# EasyEDA Pro project UHUB.eprj, schematic UHUB

## Sheets
1 USB-HUB: Board Name: Board1; Create Date: 2025-02-08; Page Name: USB-HUB; Project Name: UHUB; Schematic Name: UHUB; Update Date: 2025-03-03; Company: CAN; Page Size: A4; Version: V1.0
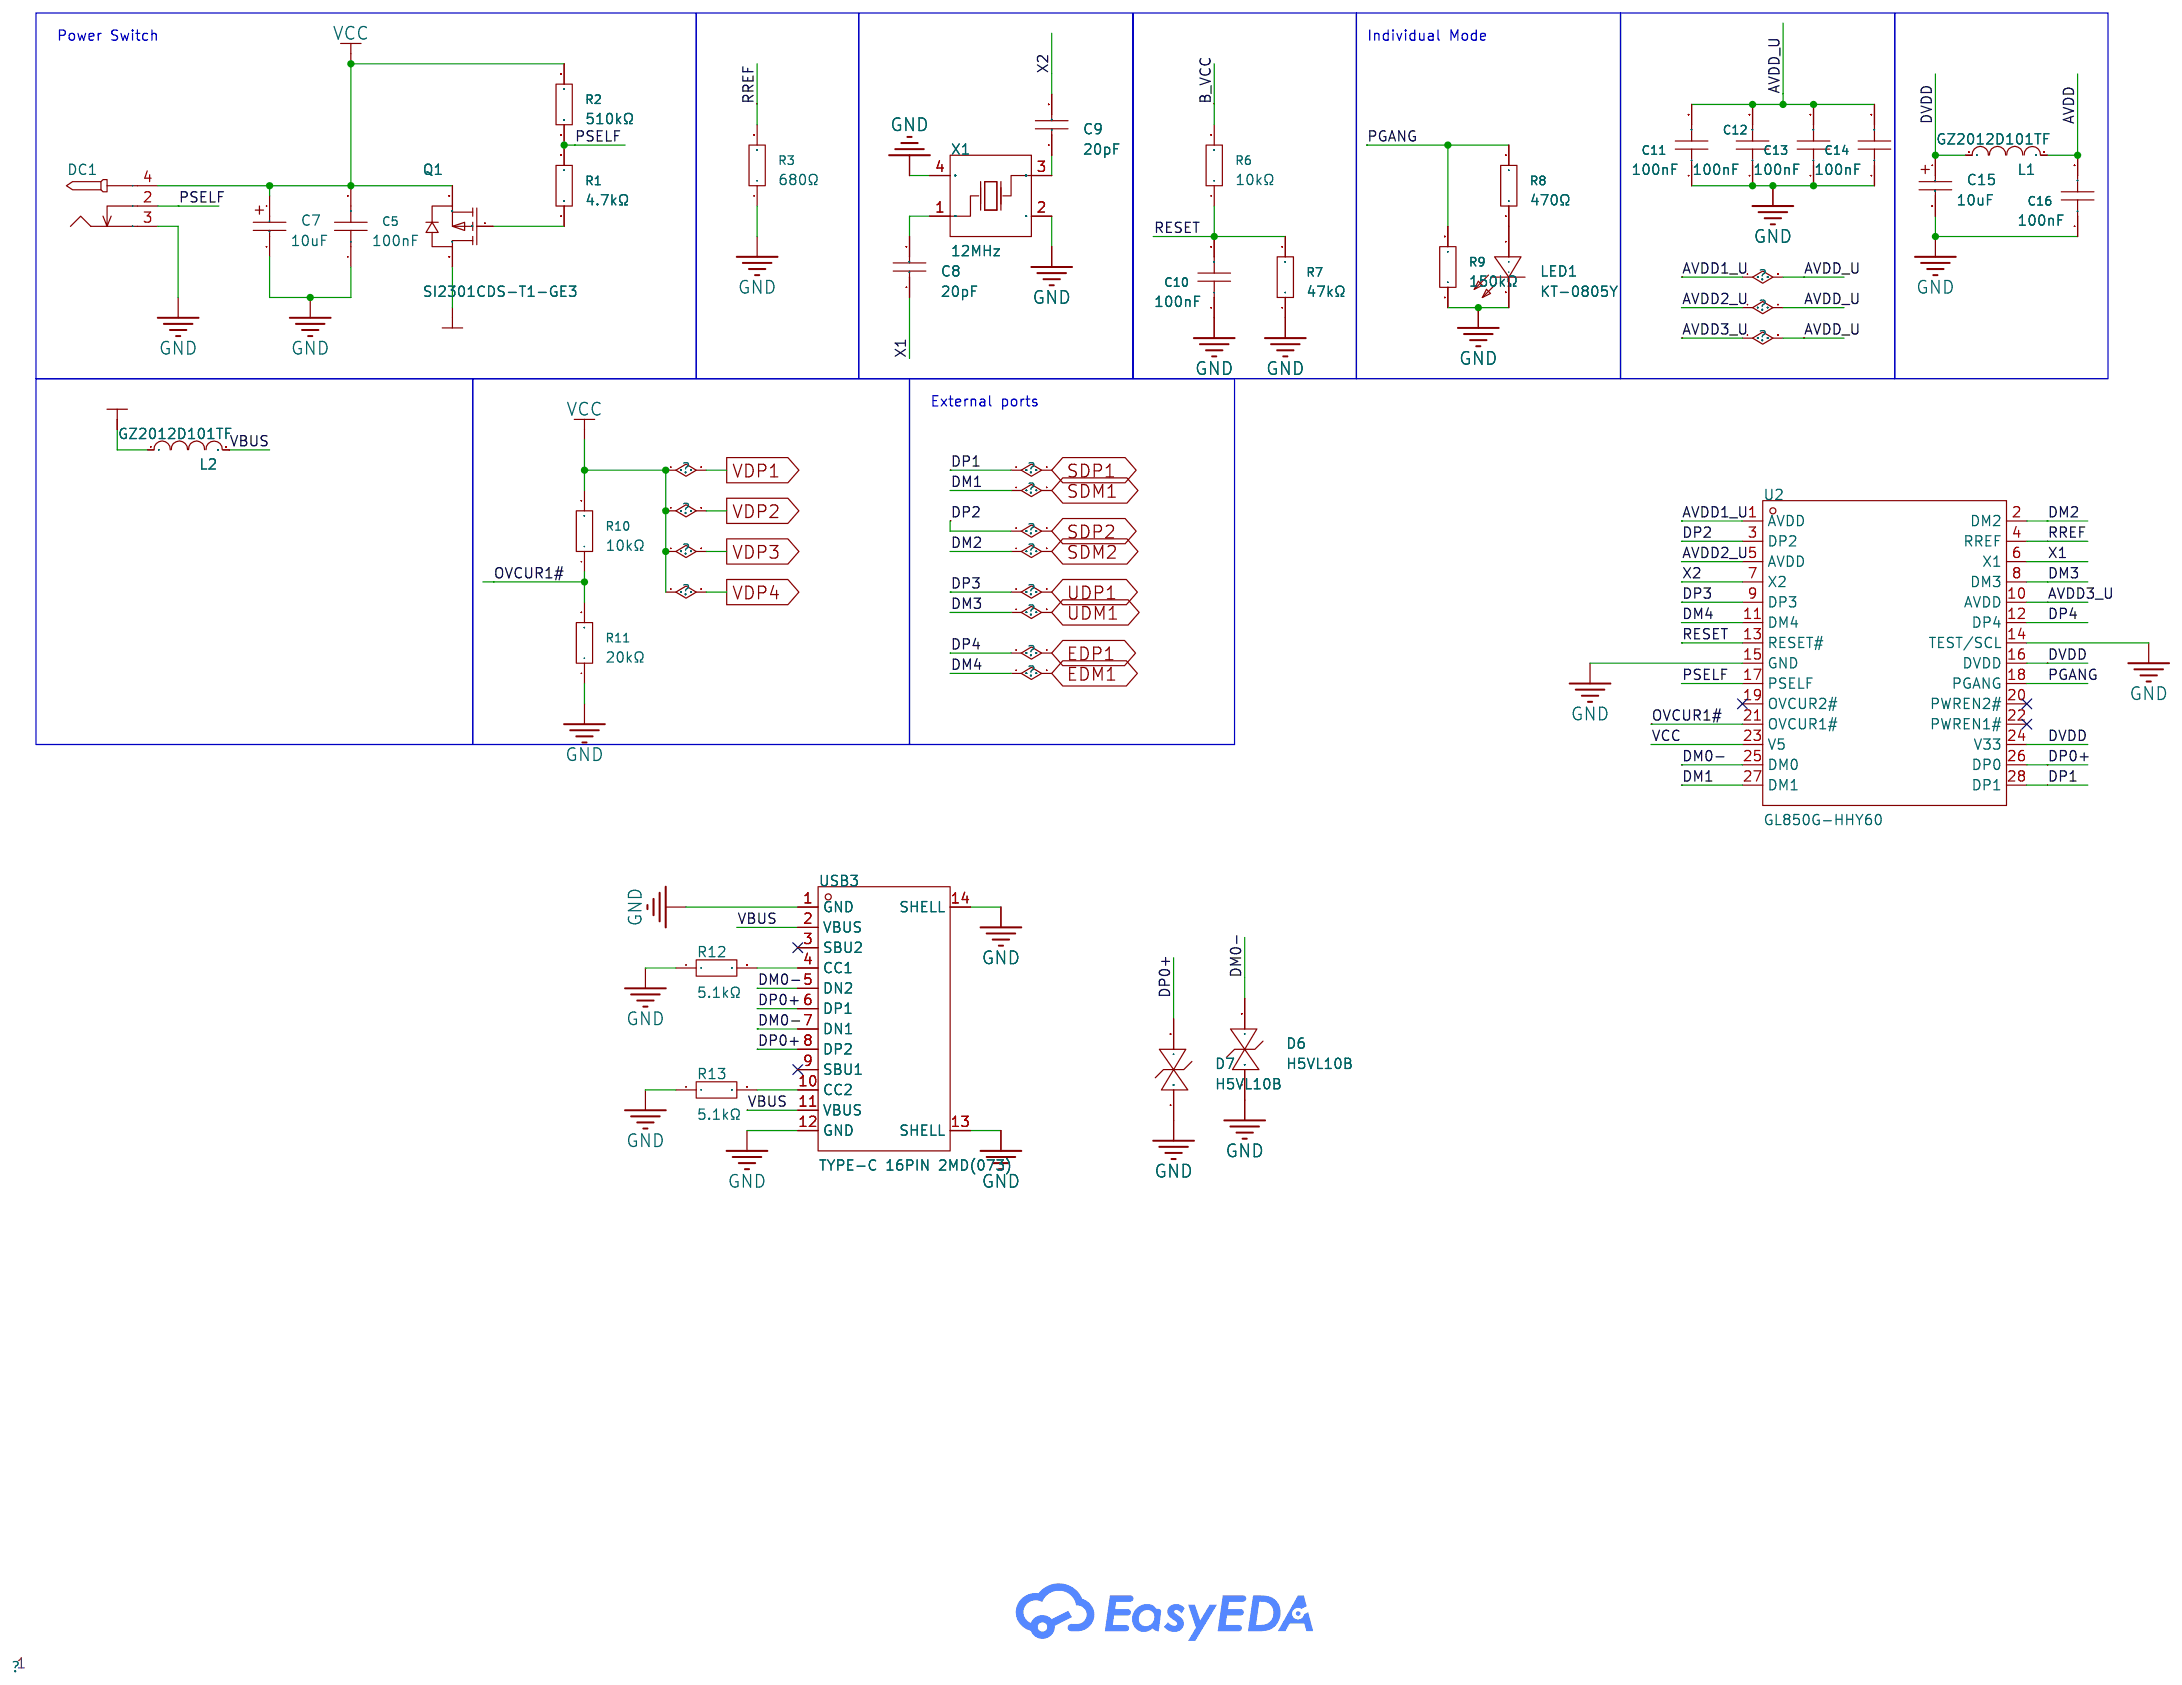
[diagram p0: USB-HUB]
2 USB-Serial: Page Name: USB-Serial; Update Date: 2025-02-23; Company: EasyEDA.com
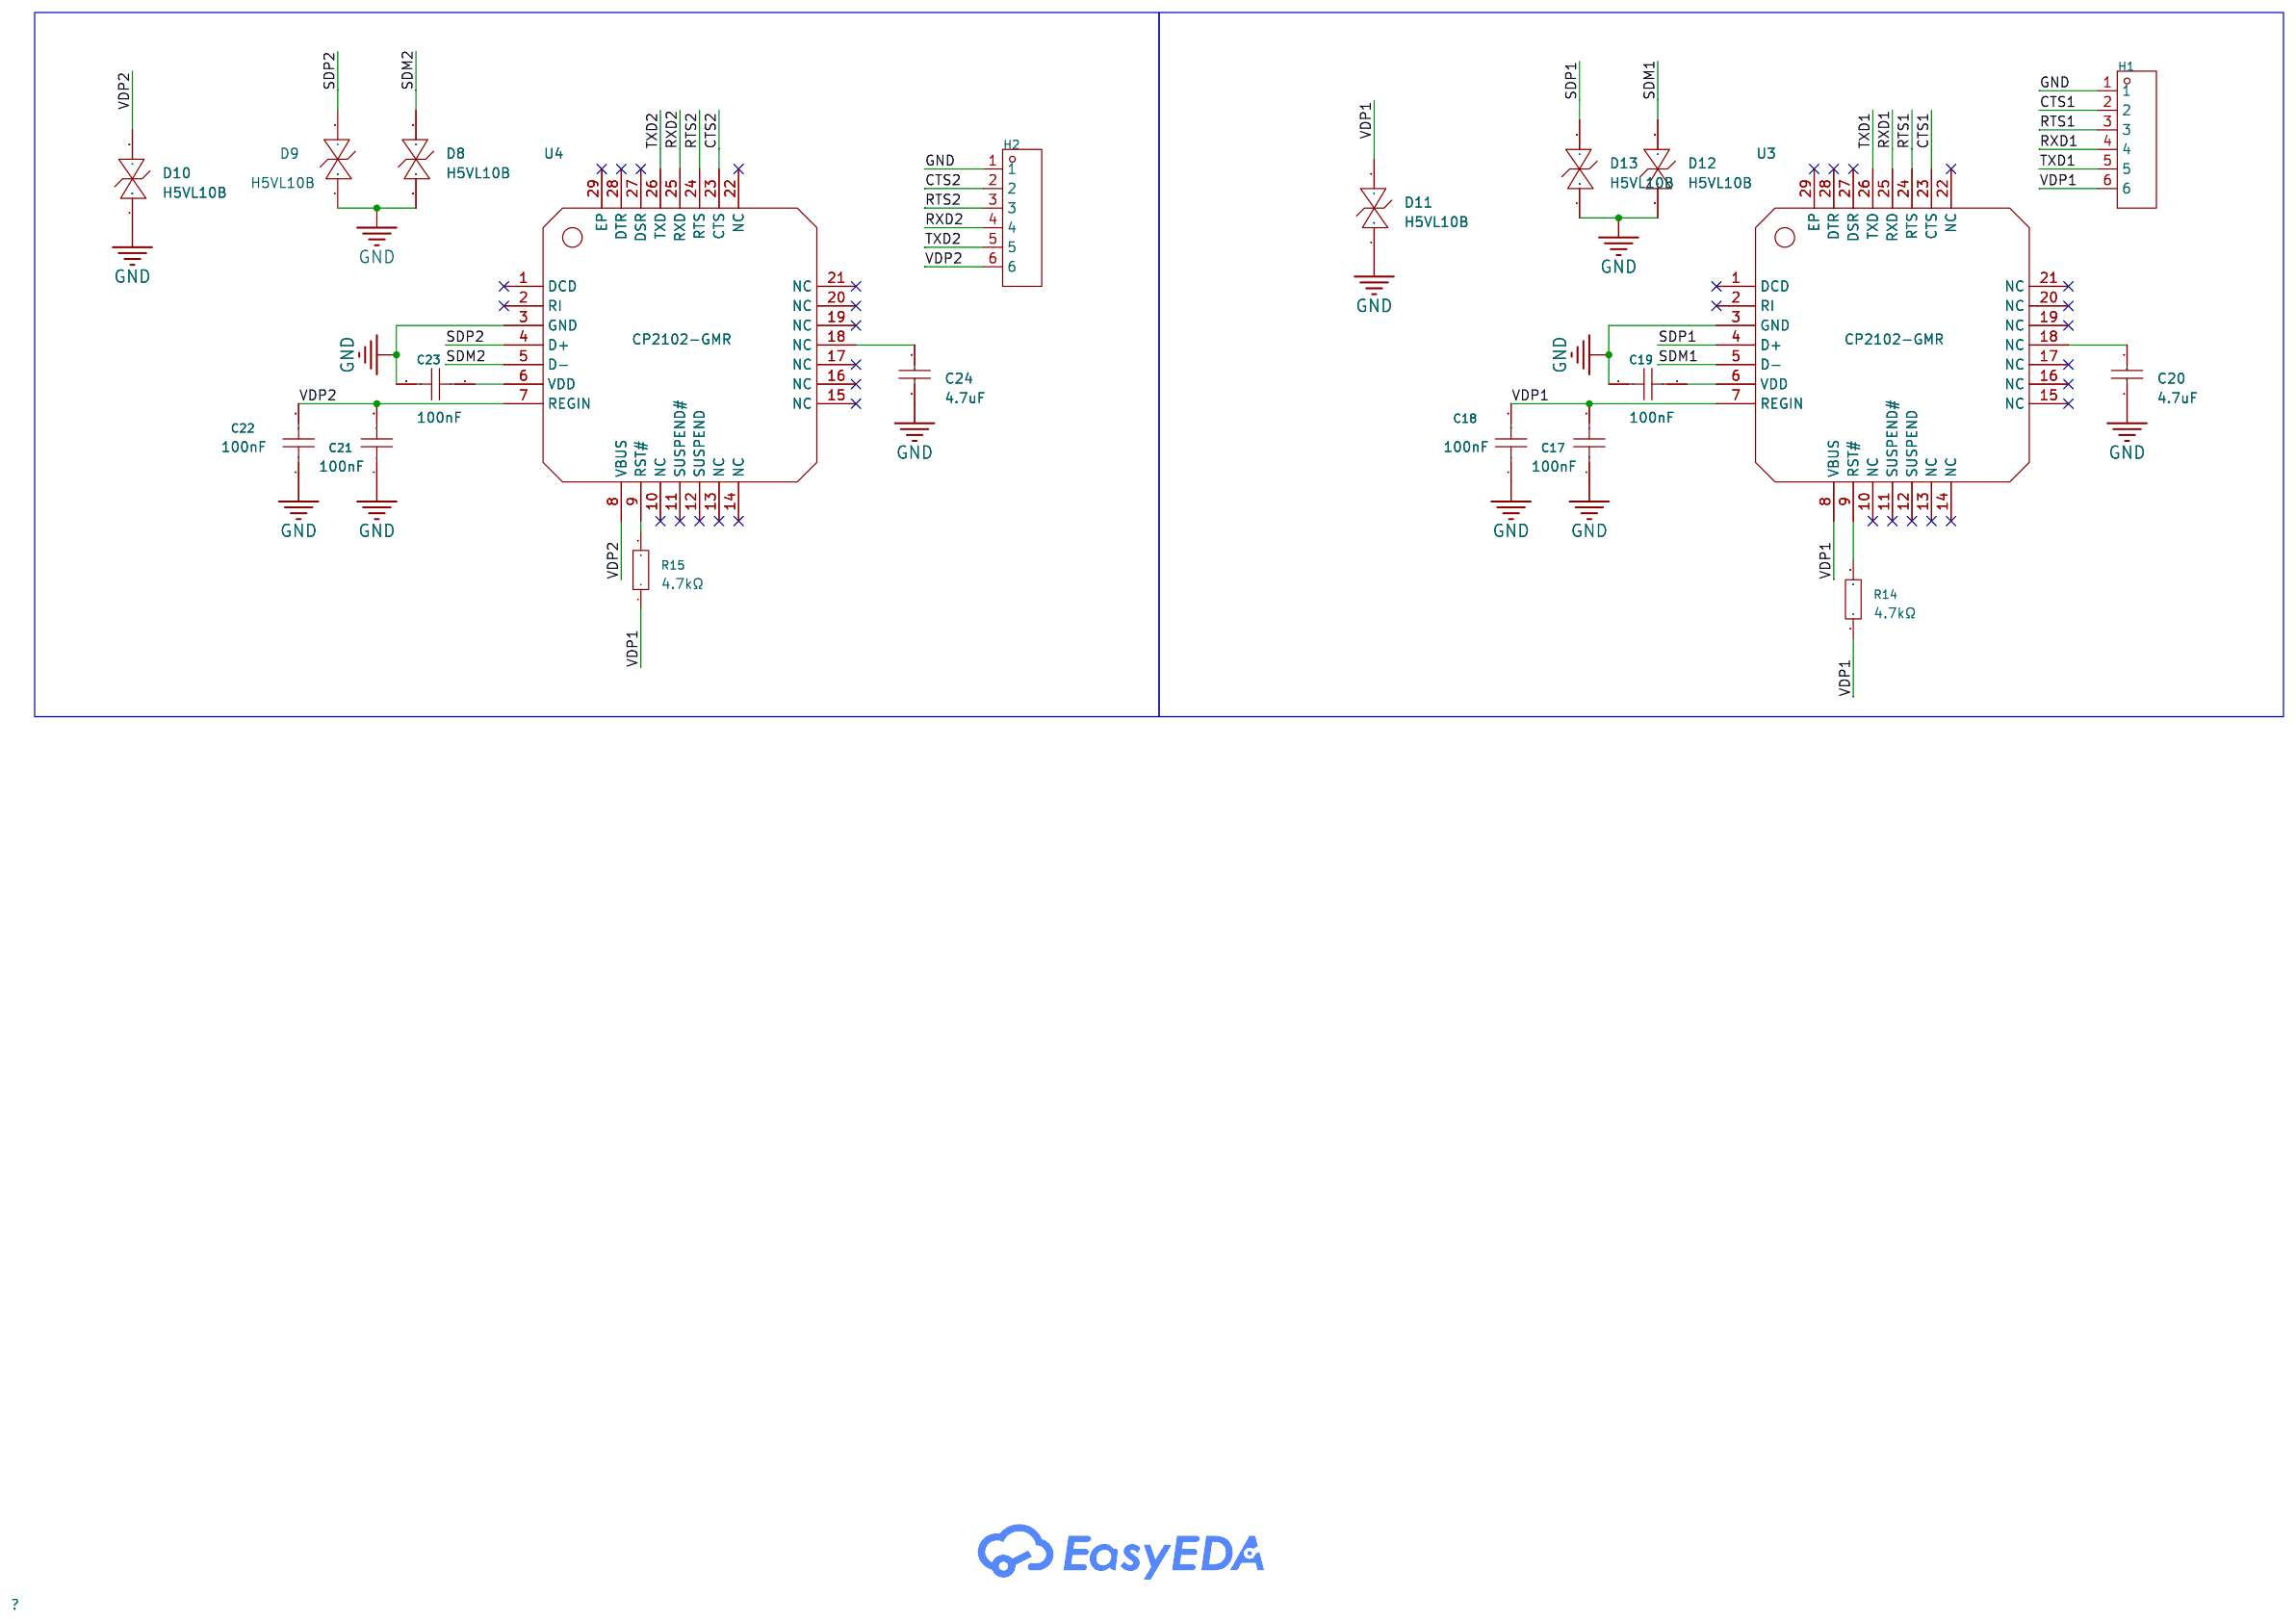
[diagram p1: USB-Serial]
3 USB-SD: Page Name: USB-SD; Update Date: 2025-02-23; Company: EasyEDA.com
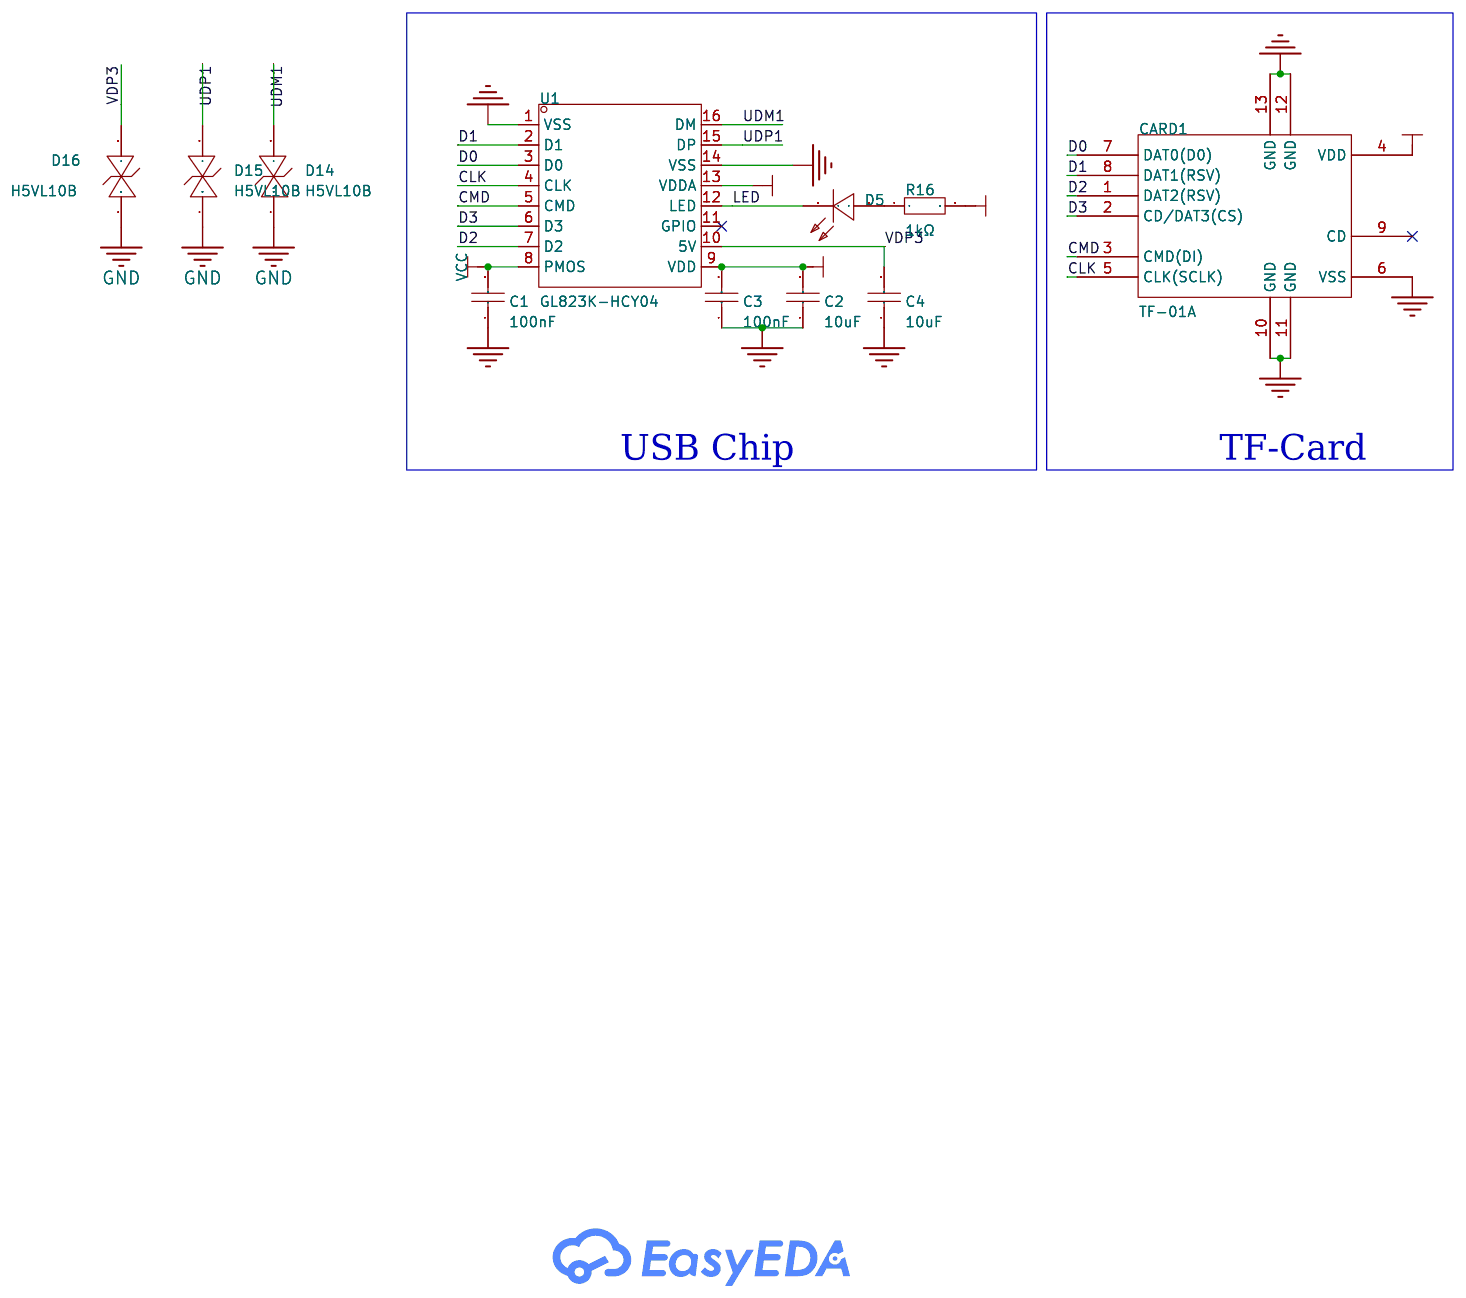
[diagram p2: USB-SD]
4 USB-ETHERNET: Page Name: USB-ETHERNET; Update Date: 2025-02-23; Company: EasyEDA.com
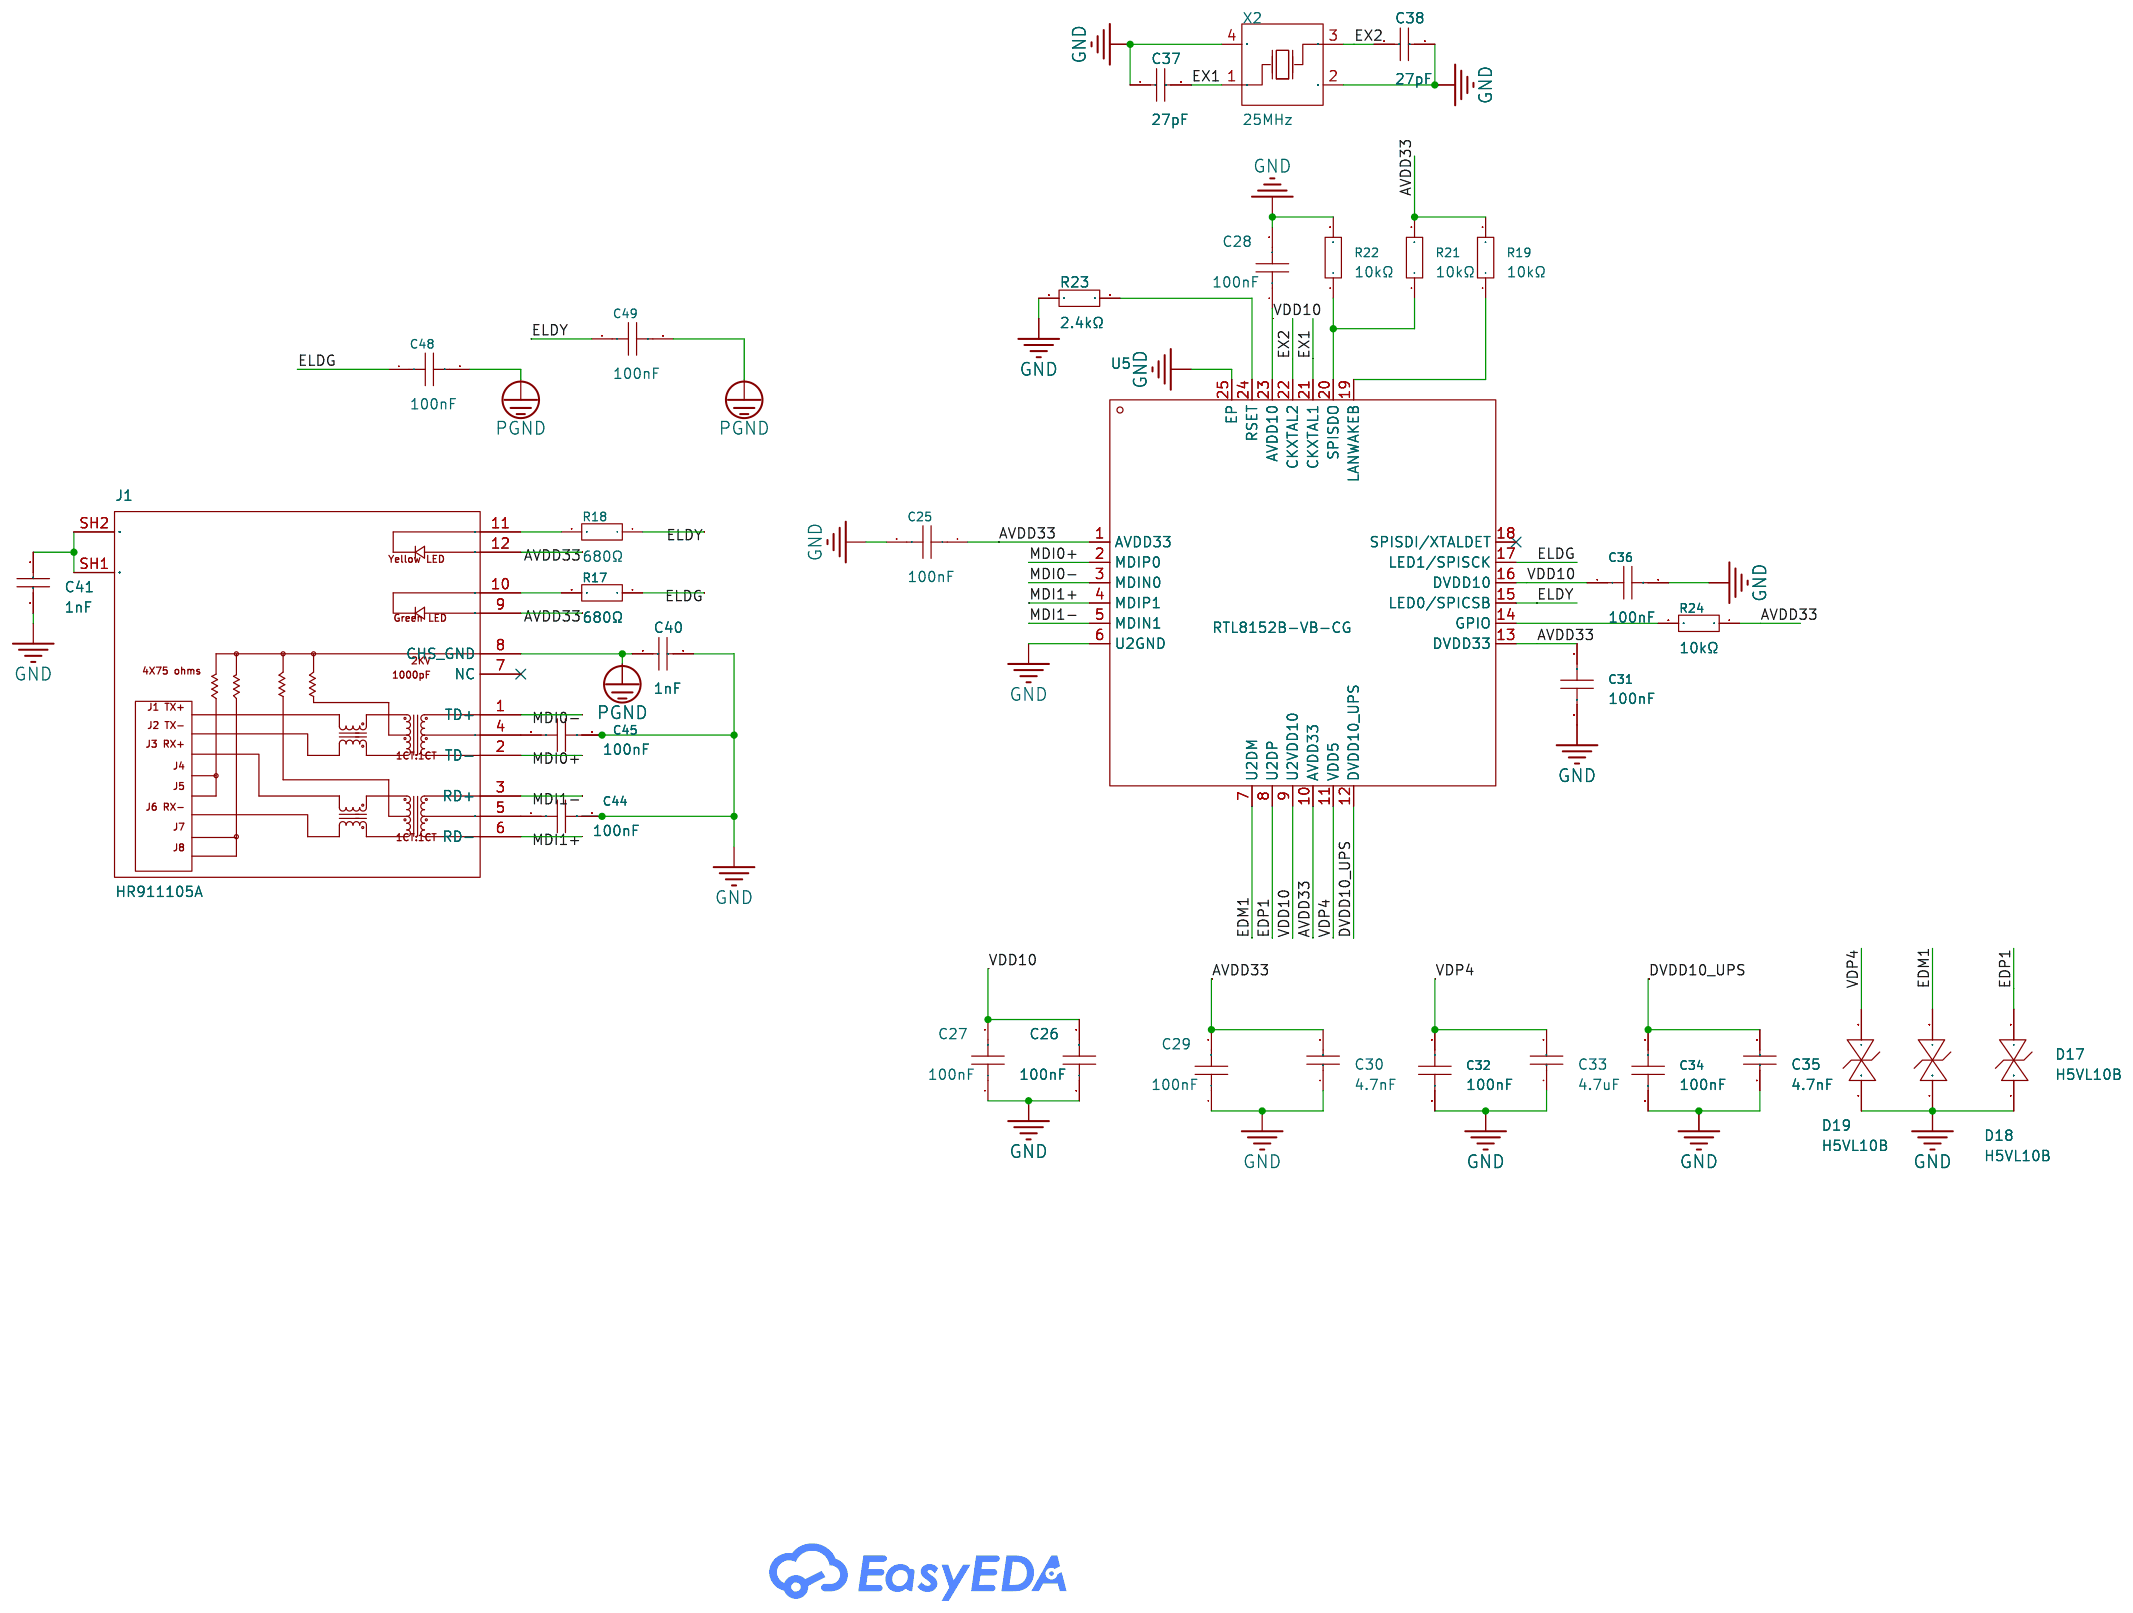
[diagram p3: USB-ETHERNET]

## Parts
sheet USB-ETHERNET
C25  100nF  [C0603]
C26  100nF  [C0402]
C27  100nF  [C0402]
C28  100nF  [C0402]
C29  100nF  [C0402]
C30  4.7nF  [C0402]
C31  100nF  [C0603]
C32  100nF  [C0603]
C33  4.7uF  [C0805]
C34  100nF  [C0603]
C35  4.7nF  [C0402]
C36  100nF  [C0603]
C37  27pF  [C0402]
C38  27pF  [C0402]
C40  1nF  [C1206]
C41  1nF  [C1206]
C44  100nF  [C0603]
C45  100nF  [C0603]
C48  100nF  [C0603]
C49  100nF  [C0603]
D17  H5VL10B  [SOD-882_L1.0-W0.6-BI]
D18  H5VL10B  [SOD-882_L1.0-W0.6-BI]
D19  H5VL10B  [SOD-882_L1.0-W0.6-BI]
J1  HR911105A  [RJ45-TH_HR911105A]
R17  680Ω  [R0805]
R18  680Ω  [R0805]
R19  10kΩ  [R0805]
R21  10kΩ  [R0805]
R22  10kΩ  [R0805]
R23  2.4kΩ  [R0805]
R24  10kΩ  [R0805]
U5  RTL8152B-VB-CG  [QFN-24_L4.0-W4.0-P0.50-BL-EP2.0]
X2  25MHz  [CRYSTAL-SMD_4P-L3.2-W2.5-BL]
sheet USB-HUB
C5  100nF  [C0603]
C7  10uF  [CAP-SMD_L3.2-W1.6-RD-C7171]
C8  20pF  [C0603]
C9  20pF  [C0603]
C10  100nF  [C0603]
C11  100nF  [C0603]
C12  100nF  [C0603]
C13  100nF  [C0603]
C14  100nF  [C0603]
C15  10uF  [CAP-SMD_L3.2-W1.6-RD-C7171]
C16  100nF  [C0603]
D6  H5VL10B  [SOD-882_L1.0-W0.6-BI]
D7  H5VL10B  [SOD-882_L1.0-W0.6-BI]
DC1  -  [DC-IN-TH_DC-5520-1]
L1  GZ2012D101TF  [L0805]
L2  GZ2012D101TF  [L0805]
LED1  KT-0805Y  [LED0805-R-RD]
Q1  SI2301CDS-T1-GE3  [SOT-23-3_L3.0-W1.7-P0.95-LS2.9-BR]
R1  4.7kΩ  [R0805]
R2  510kΩ  [R0603]
R3  680Ω  [R0805]
R6  10kΩ  [R0805]
R7  47kΩ  [R0805]
R8  470Ω  [R0805]
R9  150kΩ  [R0805]
R10  10kΩ  [R0805]
R11  20kΩ  [R0805]
R12  5.1kΩ  [R0603]
R13  5.1kΩ  [R0603]
U2  GL850G-HHY60  [SSOP-28_L10.2-W5.3-P0.65-LS7.8-BL]
USB3  TYPE-C 16PIN 2MD(073)  [USB-C-SMD_TYPE-C-6PIN-2MD-073]
X1  12MHz  [CRYSTAL-SMD_4P-L3.2-W2.5-BL]
sheet USB-SD
C1  100nF  [C0805]
C2  10uF  [C0805]
C3  100nF  [C0805]
C4  10uF  [C0805]
CARD1  TF-01A  [TF-SMD_TF-01A]
D5  KT-0805翠绿  [LED0805-R-RD]
D14  H5VL10B  [SOD-882_L1.0-W0.6-BI]
D15  H5VL10B  [SOD-882_L1.0-W0.6-BI]
D16  H5VL10B  [SOD-882_L1.0-W0.6-BI]
R16  1kΩ  [R0805]
U1  GL823K-HCY04  [SSOP-16_L4.9-W3.9-P0.64-LS6.0-BL]
sheet USB-Serial
C17  100nF  [C0603]
C18  100nF  [C0603]
C19  100nF  [C0603]
C20  4.7uF  [C0805]
C21  100nF  [C0603]
C22  100nF  [C0603]
C23  100nF  [C0603]
C24  4.7uF  [C0805]
D8  H5VL10B  [SOD-882_L1.0-W0.6-BI]
D9  H5VL10B  [SOD-882_L1.0-W0.6-BI]
D10  H5VL10B  [SOD-882_L1.0-W0.6-BI]
D11  H5VL10B  [SOD-882_L1.0-W0.6-BI]
D12  H5VL10B  [SOD-882_L1.0-W0.6-BI]
D13  H5VL10B  [SOD-882_L1.0-W0.6-BI]
H1  -  [HDR-TH_6P-P2.54-V-F]
H2  -  [HDR-TH_6P-P2.54-V-F]
R14  4.7kΩ  [R0805]
R15  4.7kΩ  [R0805]
U3  CP2102-GMR  [WQFN-28_L5.0-W5.0-P0.50-BL-EP3.2]
U4  CP2102-GMR  [WQFN-28_L5.0-W5.0-P0.50-BL-EP3.2]

## Library data of the parts
C5 C10-C14 C16-C19 C21-C23 C25 C31 C32 C34 C36 C44 C45 C48 C49 = CC0603KRX7R9BB104: Capacitance: Tolerance:±10% Tolerance:±10% Voltage Rated: Temperature Coefficient:; LCSC Part Name: 100nF ±10% 50V; Supplier Part: C14663; Manufacturer: YAGEO(国巨); Supplier Footprint: 0603; JLCPCB Part Class: Basic Part; Datasheet: https://atta.szlcsc.com/upload/public/pdf/source/20180910/C282072_33301C7F631E79921B82A8DAC6BCC5B3.pdf; Supplier: LCSC; Tolerance: ±10%; Check: true
C26-C29 = CL05B104KO5NNNC: LCSC Part Name: 100nF ±10% 16V; Supplier Part: C1525; Manufacturer: SAMSUNG(三星); Supplier Footprint: 0402; JLCPCB Part Class: Basic Part; Datasheet: https://atta.szlcsc.com/upload/public/pdf/source/20160218/1457707763339.pdf; Supplier: LCSC; Tolerance: ±10%; Check: true
C30 C35 = 0402B472K500NT: LCSC Part Name: 4.7nF ±10% 50V; Supplier Part: C1538; Manufacturer: FH(风华); Supplier Footprint: 0402; JLCPCB Part Class: Basic Part; Datasheet: https://atta.szlcsc.com/upload/public/pdf/source/20200305/C486355_26A10D38EF8C2A5C37091D0039909270.pdf; Supplier: LCSC; Tolerance: ±10%; Check: true
C20 C24 C33 = CL21A475KAQNNNE: LCSC Part Name: 4.7uF ±10% 25V; Supplier Part: C1779; Manufacturer: SAMSUNG(三星); Supplier Footprint: 0805; JLCPCB Part Class: Basic Part; Datasheet: https://atta.szlcsc.com/upload/public/pdf/source/20160218/1457707763339.pdf; Supplier: LCSC; Tolerance: ±10%; Check: true
C37 C38 = 0402CG270J500NT_C1557: LCSC Part Name: 27pF ±5% 50V; Supplier Part: C1557; Manufacturer: FH(风华); Manufacturer Part: 0402CG270J500NT; Supplier Footprint: 0402; JLCPCB Part Class: Extended Part; Datasheet: https://atta.szlcsc.com/upload/public/pdf/source/20200305/C486355_26A10D38EF8C2A5C37091D0039909270.pdf; Supplier: LCSC; Tolerance: ±5%; Check: true
C40 C41 = 1206B102K202NT: LCSC Part Name: 1nF ±10% 2kV; Supplier Part: C9196; Manufacturer: FH(风华); Supplier Footprint: 1206; JLCPCB Part Class: Basic Part; Datasheet: https://atta.szlcsc.com/upload/public/pdf/source/20200305/C486355_26A10D38EF8C2A5C37091D0039909270.pdf; Supplier: LCSC; Tolerance: ±10%; Check: true
D6-D19 = H5VL10B: LCSC Part Name: H5VL10B 丝印 PB; Supplier Part: C7420372; Manufacturer: 宏迦橙; Supplier Footprint: DFN1006-2L; JLCPCB Part Class: Extended Part; Datasheet: https://atta.szlcsc.com/upload/public/pdf/source/20230630/5024ECFEAD3C9801B07A8DBB967AB462.pdf; Supplier: LCSC; polarity: Bidirectional; Reverse Stand-Off Voltage (Vrwm): 5V; Maximum Clamping Voltage: 10V; Peak Pulse Current (Ipp): 5A; Peak Pulse Power Dissipation (Ppp): 50W; Breakdown Voltage: 5.6V; Reverse Leakage Current (Ir): 100nA; Number of Lines: Single channel; Operating Temperature: -55℃~+155℃; Type: ESD; Check: true
J1 = HR911105A_C12074: LCSC Part Name: 带LED; Supplier Part: C12074; Manufacturer: HANRUN(汉仁); Supplier Footprint: 插件; JLCPCB Part Class: Extended Part; Datasheet: https://atta.szlcsc.com/upload/public/pdf/source/20170918/C12074_1505726819496976146.pdf; Supplier: LCSC; Connector Type: RJ45Receptacle; Number of Ports: 1; LED: WithLED; PoE: Without PoE; Supplementary Features: With filtering; Check: true
R3 R17 R18 = 0805W8F6800T5E: LCSC Part Name: 680Ω ±1% 125mW 厚膜电阻; Supplier Part: C17798; Manufacturer: UNI-ROYAL(厚声); Supplier Footprint: 0805; JLCPCB Part Class: Basic Part; Datasheet: https://atta.szlcsc.com/upload/public/pdf/source/20200306/C422600_1E6D84923E4A46A82E41ADD87F860B5C.pdf; Supplier: LCSC; Type: Thick Film Resistors; Tolerance: ±1%; Temperature Coefficient: ±100ppm/℃; Operating Temperature Range: -55℃~+155℃; Check: true
R6 R10 R19 R21 R22 R24 = 0805W8F1002T5E: LCSC Part Name: 10kΩ ±1% 125mW 厚膜电阻; Supplier Part: C17414; Manufacturer: UNI-ROYAL(厚声); Supplier Footprint: 0805; JLCPCB Part Class: Basic Part; Datasheet: https://atta.szlcsc.com/upload/public/pdf/source/20200306/C422600_1E6D84923E4A46A82E41ADD87F860B5C.pdf; Supplier: LCSC; Type: Thick Film Resistors; Tolerance: ±1%; Temperature Coefficient: ±100ppm/℃; Operating Temperature Range: -55℃~+155℃; Check: true
R23 = 0805W8F2401T5E: LCSC Part Name: 2.4kΩ ±1% 125mW 厚膜电阻; Supplier Part: C17526; Manufacturer: UNI-ROYAL(厚声); Supplier Footprint: 0805; JLCPCB Part Class: Basic Part; Datasheet: https://atta.szlcsc.com/upload/public/pdf/source/20200306/C422600_1E6D84923E4A46A82E41ADD87F860B5C.pdf; Supplier: LCSC; Type: Thick Film Resistors; Tolerance: ±1%; Temperature Coefficient: ±100ppm/℃; Operating Temperature Range: -55℃~+155℃; Check: true
U5 = RTL8152B-VB-CG: LCSC Part Name: 集成10/100M以太网控制器用于USB应用; Supplier Part: C50656; Manufacturer: REALTEK(瑞昱); Supplier Footprint: QFN-24-EP(4x4); JLCPCB Part Class: Extended Part; Supplier: LCSC; channel: 1; IO Type: USB; Supply Voltage: 3.3V; Supply Current: 24mA; Operating Temperature  range: 0℃~+70℃; Check: true
X2 = X322525MOB4SI: LCSC Part Name: 25MHz ±10ppm 12pF; Supplier Part: C9006; Manufacturer: YXC(扬兴晶振); Supplier Footprint: SMD3225-4P; JLCPCB Part Class: Basic Part; Datasheet: https://atta.szlcsc.com/upload/public/pdf/source/20240329/19D5F850207469550BEB00D7DFEDBC7A.pdf; Supplier: LCSC; Crystal Type: Surface Mount Crystal; Normal temperature Frequency Tolerance: ±10ppm; Frequency Stability(Full temperature range): ±20ppm; Check: true
C7 C15 = TAJA106K016RNJ: LCSC Part Name: 10uF ±10% 16V; Supplier Part: C7171; Manufacturer: Kyocera AVX; Supplier Footprint: CASE-A-3216; JLCPCB Part Class: Basic Part; Datasheet: https://atta.szlcsc.com/upload/public/pdf/source/20160107/1457707750344.pdf; Supplier: LCSC; Tolerance: ±10%; Equivalent Series Resistance(ESR): 3Ω@100kHz; Operating Temperature: -55℃~+125℃; Check: true
C8 C9 = CL10C200JB8NNNC: LCSC Part Name: 20pF ±5% 50V; Supplier Part: C1648; Manufacturer: SAMSUNG(三星); Supplier Footprint: 0603; JLCPCB Part Class: Basic Part; Datasheet: https://atta.szlcsc.com/upload/public/pdf/source/20160218/1457707763339.pdf; Supplier: LCSC; Tolerance: ±5%; Check: true
DC1 = DC-005_2.5: Supplier Footprint: Through; Check: true
L1 L2 = GZ2012D101TF: LCSC Part Name: 单路 0805磁珠 阻抗100Ω@100MHz; Supplier Part: C1015; Manufacturer: Sunlord(顺络); Supplier Footprint: 0805; JLCPCB Part Class: Basic Part; Datasheet: https://atta.szlcsc.com/upload/public/pdf/source/20241120/893429B990C3BA07384E734821D2F218.pdf; Supplier: LCSC; Impedance @ Frequency: 100Ω@100MHz; Tolerance: ±25%; DC Resistance: 150mΩ; Current Rating: 800mA; Circuits: 1; Check: true
LED1 = KT-0805Y: LCSC Part Name: 0805 黄灯 高亮; Supplier Part: C2296; Manufacturer: KENTO; Supplier Footprint: 0805; JLCPCB Part Class: Basic Part; Datasheet: https://atta.szlcsc.com/upload/public/pdf/source/20160421/1461205044170.pdf; Supplier: LCSC; Emitted Color: Yellow; Check: true
Q1 = SI2301CDS-T1-GE3: LCSC Part Name: 1个P沟道 耐压:20V 电流:2.3A; Supplier Part: C10487; Manufacturer: VISHAY(威世); Supplier Footprint: SOT-23; JLCPCB Part Class: Basic Part; Datasheet: https://atta.szlcsc.com/upload/public/pdf/source/20180621/C10487_757133A2CC00440C4C7DD3E7E73681E9.pdf; Supplier: LCSC; Type: 1 Piece P-Channel; Drain Source On Resistance (RDS(on)@Vgs,Id): 0.112Ω@4.5V,2.8A; Power Dissipation (Pd): 0.86W; Gate Threshold Voltage (Vgs(th)@Id): 1V@250uA; Total Gate Charge (Qg@Vgs): 3.3nC@10V; Input Capacitance (Ciss@Vds): 405pF@10V; Reverse Transfer Capacitance (Crss@Vds): 55pF@10V; Operating Temperature: -55℃~+150℃; Check: true
R1 R14 R15 = 0805W8F4701T5E: LCSC Part Name: 4.7kΩ ±1% 125mW 厚膜电阻; Supplier Part: C17673; Manufacturer: UNI-ROYAL(厚声); Supplier Footprint: 0805; JLCPCB Part Class: Basic Part; Datasheet: https://atta.szlcsc.com/upload/public/pdf/source/20200306/C422600_1E6D84923E4A46A82E41ADD87F860B5C.pdf; Supplier: LCSC; Type: Thick Film Resistors; Tolerance: ±1%; Temperature Coefficient: ±100ppm/℃; Operating Temperature Range: -55℃~+155℃; Check: true
R2 = 0603WAF5103T5E: LCSC Part Name: 510kΩ ±1% 100mW 厚膜电阻; Supplier Part: C23192; Manufacturer: UNI-ROYAL(厚声); Supplier Footprint: 0603; JLCPCB Part Class: Basic Part; Datasheet: https://atta.szlcsc.com/upload/public/pdf/source/20200306/C422600_1E6D84923E4A46A82E41ADD87F860B5C.pdf; Supplier: LCSC; Type: Thick Film Resistors; Tolerance: ±1%; Temperature Coefficient: ±100ppm/℃; Operating Temperature Range: -55℃~+155℃; Check: true
R7 = 0805W8F4702T5E: LCSC Part Name: 47kΩ ±1% 125mW 厚膜电阻; Supplier Part: C17713; Manufacturer: UNI-ROYAL(厚声); Supplier Footprint: 0805; JLCPCB Part Class: Basic Part; Datasheet: https://atta.szlcsc.com/upload/public/pdf/source/20200306/C422600_1E6D84923E4A46A82E41ADD87F860B5C.pdf; Supplier: LCSC; Type: Thick Film Resistors; Tolerance: ±1%; Temperature Coefficient: ±100ppm/℃; Operating Temperature Range: -55℃~+155℃; Check: true
R8 = 0805W8F4700T5E: LCSC Part Name: 470Ω ±1% 125mW 厚膜电阻; Supplier Part: C17710; Manufacturer: UNI-ROYAL(厚声); Supplier Footprint: 0805; JLCPCB Part Class: Basic Part; Datasheet: https://atta.szlcsc.com/upload/public/pdf/source/20200306/C422600_1E6D84923E4A46A82E41ADD87F860B5C.pdf; Supplier: LCSC; Type: Thick Film Resistors; Tolerance: ±1%; Temperature Coefficient: ±100ppm/℃; Operating Temperature Range: -55℃~+155℃; Check: true
R9 = 0805W8F1503T5E: LCSC Part Name: 150kΩ ±1% 125mW 厚膜电阻; Supplier Part: C17470; Manufacturer: UNI-ROYAL(厚声); Supplier Footprint: 0805; JLCPCB Part Class: Basic Part; Datasheet: https://atta.szlcsc.com/upload/public/pdf/source/20200306/C422600_1E6D84923E4A46A82E41ADD87F860B5C.pdf; Supplier: LCSC; Type: Thick Film Resistors; Tolerance: ±1%; Temperature Coefficient: ±100ppm/℃; Operating Temperature Range: -55℃~+155℃; Check: true
R11 = 0805W8F2002T5E: LCSC Part Name: 20kΩ ±1% 125mW 厚膜电阻; Supplier Part: C4328; Manufacturer: UNI-ROYAL(厚声); Supplier Footprint: 0805; JLCPCB Part Class: Basic Part; Datasheet: https://atta.szlcsc.com/upload/public/pdf/source/20200306/C422600_1E6D84923E4A46A82E41ADD87F860B5C.pdf; Supplier: LCSC; Type: Thick Film Resistors; Tolerance: ±1%; Temperature Coefficient: ±100ppm/℃; Operating Temperature Range: -55℃~+155℃; Check: true
R12 R13 = 0603WAF5101T5E: LCSC Part Name: 5.1kΩ ±1% 100mW 厚膜电阻; Supplier Part: C23186; Manufacturer: UNI-ROYAL(厚声); Supplier Footprint: 0603; JLCPCB Part Class: Basic Part; Datasheet: https://atta.szlcsc.com/upload/public/pdf/source/20200306/C422600_1E6D84923E4A46A82E41ADD87F860B5C.pdf; Supplier: LCSC; Type: Thick Film Resistors; Tolerance: ±1%; Temperature Coefficient: ±100ppm/℃; Operating Temperature Range: -55℃~+155℃; Check: true
U2 = GL850G-HHY60: Supplier Part: C7501406; Manufacturer: GENESYS(创惟); Supplier Footprint: SSOP-28; JLCPCB Part Class: Extended Part; Supplier: LCSC; Check: true
USB3 = TYPE-C 16PIN 2MD(073): LCSC Part Name: Type-C 母 卧贴; Supplier Part: C2765186; Manufacturer: SHOU HAN(首韩); Supplier Footprint: SMD; JLCPCB Part Class: Extended Part; Datasheet: https://atta.szlcsc.com/upload/public/pdf/source/20211123/39B17C16241EAC15C5E277BDA434118E.pdf; Supplier: LCSC; Connector Type: Type-C; Standard: USB 3.1; Gender: Female; Mounting Style: Horizontal attachment; Number of Contacts: 16P; Number of Ports: 1; Current Rating - Power (Max): 5A; Operating Temperature Range: -25℃~+85℃; Rated Voltage (Max): 5V; Connect-Disconnect Life: 5000 Cuts; Core Colour: Black; Check: true
X1 = X322512MSB4SI: LCSC Part Name: 12MHz ±10ppm 20pF; Supplier Part: C9002; Manufacturer: YXC(扬兴晶振); Supplier Footprint: SMD3225-4P; JLCPCB Part Class: Basic Part; Datasheet: https://atta.szlcsc.com/upload/public/pdf/source/20240329/19D5F850207469550BEB00D7DFEDBC7A.pdf; Supplier: LCSC; Crystal Type: Surface Mount Crystal; Normal temperature Frequency Tolerance: ±10ppm; Frequency Stability(Full temperature range): ±20ppm; Check: true
C1 C3 = CL21B104KCFNNNE: 容值:100nF;精度:±10%;额定电压:100V;材质(温度系数):X7R;; LCSC Part Name: 100nF ±10% 100V; Supplier Part: C28233; Manufacturer: SAMSUNG(三星); Supplier Footprint: 0805; Datasheet: https://atta.szlcsc.com/upload/public/pdf/source/20160103/1457707716102.pdf; Supplier: LCSC; Tolerance: ±10%; Voltage Rated: 100V; Temperature Coefficient: X7R; Check: true
C2 C4 = CL21A106KAYNNNE_C15850: 容值:10uF;精度:±10%;额定电压:25V;材质(温度系数):X5R;; LCSC Part Name: 10uF ±10% 25V; Supplier Part: C15850; Manufacturer: SAMSUNG(三星); Manufacturer Part: CL21A106KAYNNNE; Supplier Footprint: 0805; Datasheet: https://atta.szlcsc.com/upload/public/pdf/source/20160103/1457707679302.pdf; Supplier: LCSC; Tolerance: ±10%; Voltage Rated: 25V; Temperature Coefficient: X5R; Check: true
CARD1 = TF-01A_C91145: 工作温度范围:-;本体最大高度:-;触头镀层:-;连接器类型:卡座;卡类型:MicroSD卡(TF卡);焊接温度(最大值):-;触头材质:-;卡连接方式:自弹式;; Supplier Part: C91145; Manufacturer: 韩国韩荣; Supplier Footprint: SMD; JLCPCB Part Class: 扩展库; Datasheet: https://atta.szlcsc.com/upload/public/pdf/source/20190322/C91145_63CBD6FB4639A3A3EC6A9721F18AE0FB.pdf; Supplier: LCSC; Connector Type: 卡座; Card Type: MicroSD卡(TF卡); Card Connection Mode: 自弹式; Check: true
D5 = KT-0805翠绿: 发光颜色:翠绿;二极管配置:-;主波长:-;色温:-;光通量(25℃时):-;发光强度:-;功率:-;安装方式:-;; LCSC Part Name: 0805翠绿（250-300mcd); Supplier Part: F; Manufacturer: KENTO; Supplier Footprint: 0805; Datasheet: https://atta.szlcsc.com/upload/public/pdf/source/20170209/1486607340485.pdf; Supplier: LCSC; Emitted Color: 翠绿; Check: true
R16 = 0805W8F1001T5E: 电阻类型:厚膜电阻;阻值:1kΩ;精度:±1%;功率:125mW;; LCSC Part Name: 1kΩ ±1% 125mW; Supplier Part: C17513; Manufacturer: UNI-ROYAL(厚声); Supplier Footprint: 0805; Datasheet: https://atta.szlcsc.com/upload/public/pdf/source/20200306/C422600_1E6D84923E4A46A82E41ADD87F860B5C.pdf; Supplier: LCSC; Type: 厚膜电阻; Tolerance: ±1%; Power(Watts): 125mW; Temperature Coefficient: ±100ppm/℃; Overload Voltage (Max): 150V; Operating Temperature Range: -55℃~+155℃; Check: true
U1 = GL823K-HCY04: 类型:-;协议类别:-;驱动器/接收器数:-;数据速率:-;; Supplier Part: C284879; Manufacturer: GENESYS(创惟); Supplier Footprint: SSOP-16; JLCPCB Part Class: 扩展库; Datasheet: https://atta.szlcsc.com/upload/public/pdf/source/20190212/C284879_D3054E8AA735401C3047DCECFFFED6D3.pdf; Supplier: LCSC; Check: true
H1 H2 = HDR-F_2.54_1x6P: Supplier Footprint: Through; Check: true
U3 U4 = CP2102-GMR: LCSC Part Name: 单芯片USB转UART桥接器; Supplier Part: C6568; Manufacturer: SKYWORKS/SILICON LABS(芯科); Supplier Footprint: WQFN-28-EP(5x5); JLCPCB Part Class: Extended Part; Datasheet: https://atta.szlcsc.com/upload/public/pdf/source/20170103/1483439882795.pdf; Supplier: LCSC; Applications Function: Transceiver; Supply Voltage: 3V~3.6V; Data Rate: 12Mbps; Check: true

## Nets
AVDD: C16.2 L1.2
AVDD1_U: C11.2 C12.2 C13.2 C14.2 U2.1(AVDD) U2.5(AVDD) U2.10(AVDD)
AVDD33: C25.1 C29.2 C30.2 C31.1 J1.9 J1.12 R19.2 R21.2 R24.1 U5.1(AVDD33) U5.10(AVDD33) U5.13(DVDD33)
DVDD: C15.1 L1.1 U2.16(DVDD) U2.24(V33)
DVDD10_UPS: C34.1 C35.2 U5.12(DVDD10_UPS)
GND: C1.1 C2.1 C3.1 C4.1 C5.1 C7.2 C10.1 C11.1 C12.1 C13.1 C14.1 C15.2 C16.1 C17.1 C18.1 C19.2 C20.1 C21.1 C22.1 C23.2 C24.1 C25.2 C26.1 C27.1 C28.2 C29.1 C30.1 C31.2 C32.2 C33.1 C34.2 C35.1 C36.2 C37.1 C38.2 C40.1 C41.1 C44.2 C45.2 CARD1.6(VSS) CARD1.10(GND) CARD1.11(GND) CARD1.12(GND) CARD1.13(GND) D6.1(C) D7.1(C) D8.1(C) D9.1(C) D10.1(C) D11.1(C) D12.1(C) D13.1(C) D14.1(C) D15.1(C) D16.1(C) D17.1(C) D18.1(C) D19.1(C) DC1.3 H1.1 H2.1 LED1.2(-) R3.1 R7.1 R9.1 R11.1 R12.1 R13.1 R22.2 R23.1 U1.1(VSS) U1.14(VSS) U2.14(TEST/SCL) U2.15(GND) U3.3(GND) U4.3(GND) U5.6(U2GND) U5.25(EP) USB3.1(GND) USB3.12(GND) USB3.13(SHELL) USB3.14(SHELL) X1.2(GND) X1.4(GND) X2.2(GND) X2.4(GND)
PGND: C40.2 C48.2 C49.2 J1.8(CHS GND)
VBUS: L2.2 USB3.2(VBUS) USB3.11(VBUS)
VCC: C1.2 C4.2 C5.2 C7.1 C17.2 C18.2 C21.2 C22.2 C32.1 C33.2 CARD1.4(VDD) D10.2(A) D11.2(A) D16.2(A) D19.2(A) DC1.4 H1.6 H2.6 Q1.2(S) R2.1 R10.2 R14.1 R15.1 U1.8(PMOS) U1.10(5V) U2.23(V5) U3.7(REGIN) U3.8(VBUS) U4.7(REGIN) U4.8(VBUS) U5.11(VDD5)
VDD: C2.2 C3.2 R16.2 U1.9(VDD) U1.13(VDDA)
VDD10: C26.2 C27.2 C28.1 C36.1 U5.9(U2VDD10) U5.16(DVDD10) U5.23(AVDD10)
B_VCC: L2.1 Q1.3(D) R6.2
CLK: CARD1.5(CLK(SCLK)) U1.4(CLK)
CMD: CARD1.3(CMD(DI)) U1.5(CMD)
CTS1: H1.2 U3.23(CTS)
CTS2: H2.2 U4.23(CTS)
D0: CARD1.7(DAT0(D0)) U1.3(D0)
D1: CARD1.8(DAT1(RSV)) U1.2(D1)
D2: CARD1.1(DAT2(RSV)) U1.7(D2)
D3: CARD1.2(CD/DAT3(CS)) U1.6(D3)
DM0-: D6.2(A) U2.25(DM0) USB3.5(DN2) USB3.7(DN1)
DM1: D12.2(A) U2.27(DM1) U3.5(D-)
DM2: D8.2(A) U2.2(DM2) U4.5(D-)
DM3: D14.2(A) U1.16(DM) U2.8(DM3)
DM4: D18.2(A) U2.11(DM4) U5.7(U2DM)
DP0+: D7.2(A) U2.26(DP0) USB3.6(DP1) USB3.8(DP2)
DP1: D13.2(A) U2.28(DP1) U3.4(D+)
DP2: D9.2(A) U2.3(DP2) U4.4(D+)
DP3: D15.2(A) U1.15(DP) U2.9(DP3)
DP4: D17.2(A) U2.12(DP4) U5.8(U2DP)
ELDG: C48.1 R17.1 U5.17(LED1/SPISCK)
ELDY: C49.1 R18.1 U5.15(LED0/SPICSB)
EX1: C37.2 U5.21(CKXTAL1) X2.1(OSC1)
EX2: C38.1 U5.22(CKXTAL2) X2.3(OSC2)
LED: D5.2(K) U1.12(LED)
MDI0+: J1.2(TD-) U5.2(MDIP0)
MDI0-: J1.1(TD+) U5.3(MDIN0)
MDI1+: J1.6(RD-) U5.4(MDIP1)
MDI1-: J1.3(RD+) U5.5(MDIN1)
OVCUR1#: R10.1 R11.2 U2.21(OVCUR1#)
PGANG: R8.2 R9.2 U2.18(PGANG)
PSELF: DC1.2 R1.2 R2.2 U2.17(PSELF)
RESET: C10.2 R6.1 R7.2 U2.13(RESET#)
RREF: R3.2 U2.4(RREF)
RTS1: H1.3 U3.24(RTS)
RTS2: H2.3 U4.24(RTS)
RXD1: H1.4 U3.25(RXD)
RXD2: H2.4 U4.25(RXD)
TXD1: H1.5 U3.26(TXD)
TXD2: H2.5 U4.26(TXD)
X1: C8.1 U2.6(X1)
X2: C9.2 U2.7(X2)
$1N1679: C8.2 X1.1(OSC1)
$1N1684: C9.1 X1.3(OSC2)
$1N2871: LED1.1(+) R8.1
$1N4675: Q1.1(G) R1.1
$2N485: C19.1 U3.6(VDD)
$2N582: C20.2 U3.18(NC)
$2N648: R14.2 U3.9(RST#)
$2N1526: R15.2 U4.9(RST#)
$2N1544: C23.1 U4.6(VDD)
$2N1563: C24.2 U4.18(NC)
$3N719: D5.1(A) R16.1
$4N1390: J1.10 R17.2
$4N1394: J1.11 R18.2
$4N2084: R21.1 R22.1 U5.20(SPISDO)
$4N2129: R19.1 U5.19(LANWAKEB)
$4N2509: R23.2 U5.24(RSET)
$4N5193: C41.2 J1.SH1 J1.SH2
$4N5478: C44.1 J1.5
$4N5537: C45.1 J1.4
$4N7995: R24.2 U5.14(GPIO)
Net-(R12-2): R12.2 USB3.4(CC1)
Net-(R13-2): R13.2 USB3.10(CC2)

Not connected (* = marked no-connect by the designer): CARD1 9(CD)*; J1 7(NC)*; U1 11(GPIO)*; U2 19(OVCUR2#)* 20(PWREN2#)* 22(PWREN1#)*; U3 1(DCD)* 2(RI)* 10(NC)* 11(SUSPEND#)* 12(SUSPEND)* 13(NC)* 14(NC)* 15(NC)* 16(NC)* 17(NC)* 19(NC)* 20(NC)* 21(NC)* 22(NC)* 27(DSR)* 28(DTR)* 29(EP)*; U4 1(DCD)* 2(RI)* 10(NC)* 11(SUSPEND#)* 12(SUSPEND)* 13(NC)* 14(NC)* 15(NC)* 16(NC)* 17(NC)* 19(NC)* 20(NC)* 21(NC)* 22(NC)* 27(DSR)* 28(DTR)* 29(EP)*; U5 18(SPISDI/XTALDET)*; USB3 3(SBU2)* 9(SBU1)*

## Notes on the sheets
sheet 1
- Power Switch
- Individual Mode
- External ports
sheet 3
- USB Chip
- TF-Card
